# EAGLE design RFM73 Cape (EAGLE 6.5.0)
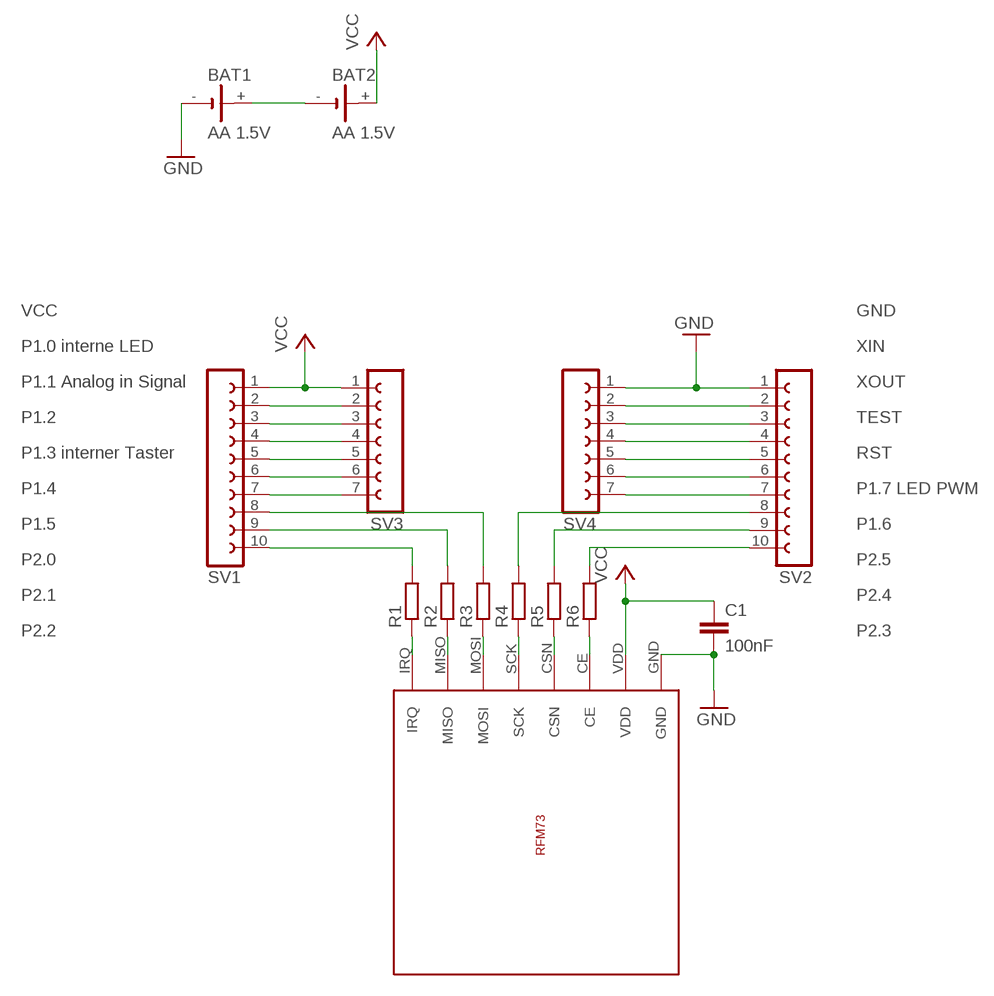
[diagram p0: schematic, sheet 1]

## Parts
BAT1  AA 1.5V  SL-160AA/PR  [SL-160AA/PR]
BAT2  AA 1.5V  SL-160AA/PR  [SL-160AA/PR]
C1  100nF  C-EUC0805  [C0805]
R1  R-EU_R0805W  [R0805W]
R2  R-EU_R0805W  [R0805W]
R3  R-EU_R0805W  [R0805W]
R4  R-EU_R0805W  [R0805W]
R5  R-EU_R0805W  [R0805W]
R6  R-EU_R0805W  [R0805W]
SV1  FE10-1  [FE10]
SV2  FE10-1  [FE10]
SV3  FE07-1  [FE07]
SV4  FE07-1  [FE07]
U$1  RFM73  [RFM73]

## Nets
GND: BAT1.- C1.2 SV2.1 SV4.1 U$1.GND
N$1: R1.2 SV1.10
N$2: BAT1.+ BAT2.-
N$3: R2.2 SV1.9
N$4: R3.2 SV1.8
N$5: R4.2 SV2.8
N$6: R5.2 SV2.9
N$7: R6.2 SV2.10
N$8: SV1.2 SV3.2
N$9: SV1.3 SV3.3
N$10: SV1.4 SV3.4
N$11: SV1.5 SV3.5
N$12: SV1.6 SV3.6
N$13: SV1.7 SV3.7
N$14: SV2.2 SV4.2
N$15: SV2.3 SV4.3
N$16: SV2.4 SV4.4
N$17: SV2.5 SV4.5
N$18: SV2.6 SV4.6
N$19: SV2.7 SV4.7
N$20: R1.1 U$1.IRQ
N$21: R2.1 U$1.MISO
N$22: R3.1 U$1.MOSI
N$23: R4.1 U$1.SCK
N$24: R5.1 U$1.CSN
N$25: R6.1 U$1.CE
VCC: BAT2.+ C1.1 SV1.1 SV3.1 U$1.VDD

## Notes on the sheet
- VCC | GND
- P1.0 interne LED | XIN
- P1.1 Analog in Signal | XOUT
- P1.2 | TEST
- P1.3 interner Taster | RST
- P1.4 | P1.7 LED PWM
- P1.5 | P1.6
- P2.0 | P2.5
- P2.1 | P2.4
- P2.2 | P2.3

## Library data of the parts
BAT1 BAT2 = CHA_lib:SL-160AA/PR: LI BATTERY Sonnenschein
C1 = rcl:C-EU: CAPACITOR, European symbol
R1-R6 = rcl:R-EU_: RESISTOR, European symbol
SV1 SV2 = con-lsta:FE10-1: FEMALE HEADER
SV3 SV4 = con-lsta:FE07-1: FEMALE HEADER; OC_FARNELL: unknown; OC_NEWARK: unknown
U$1 = CHA_lib:RFM73

## Board
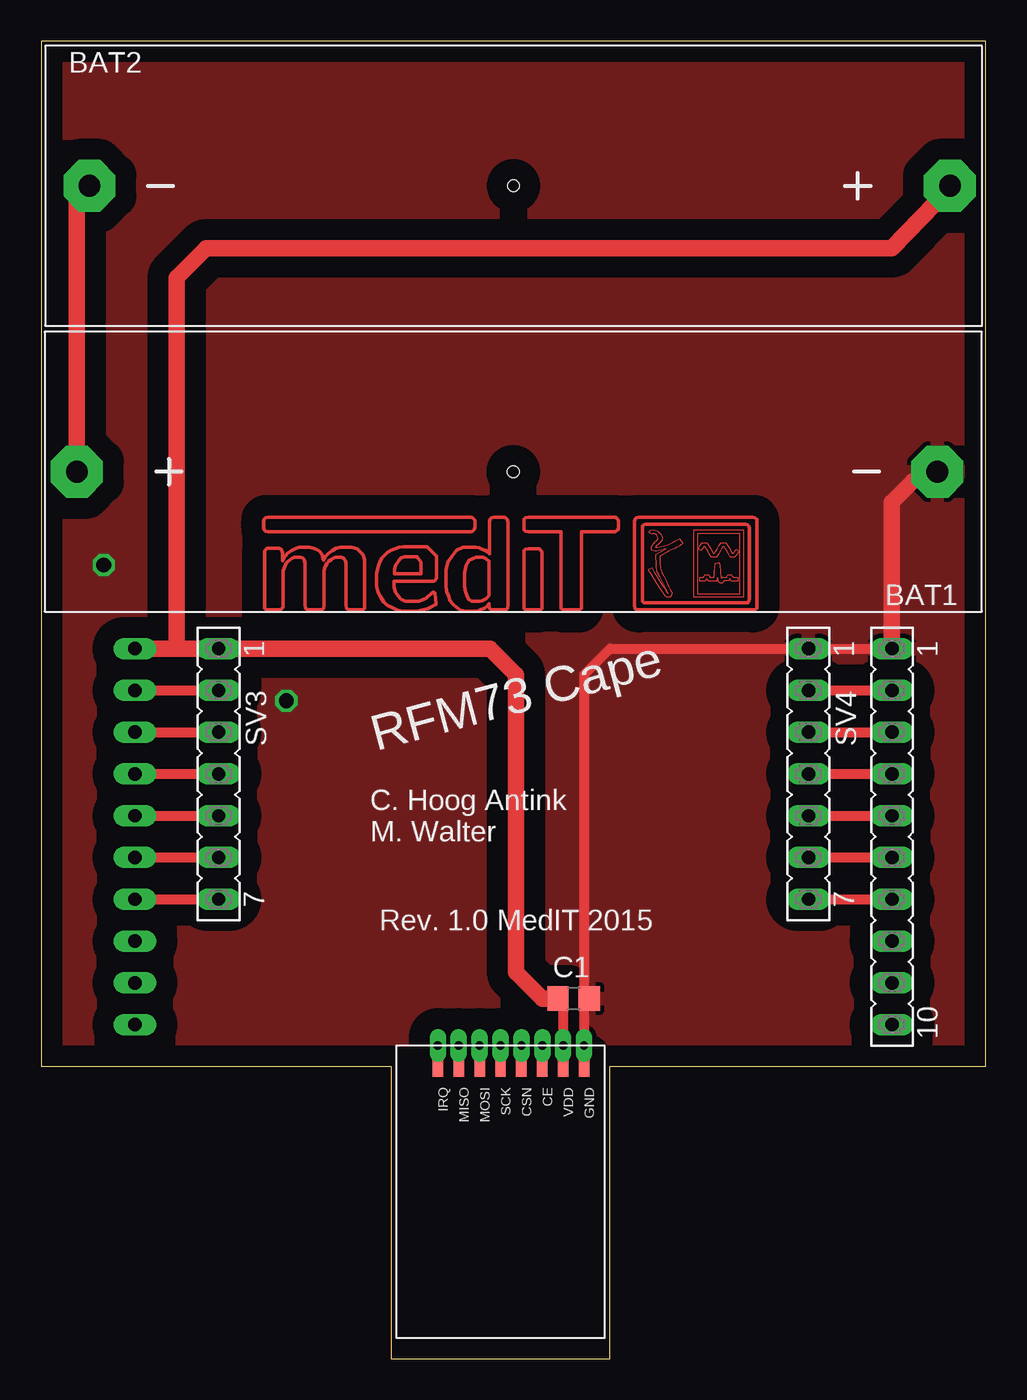
[diagram p1: board, top side]
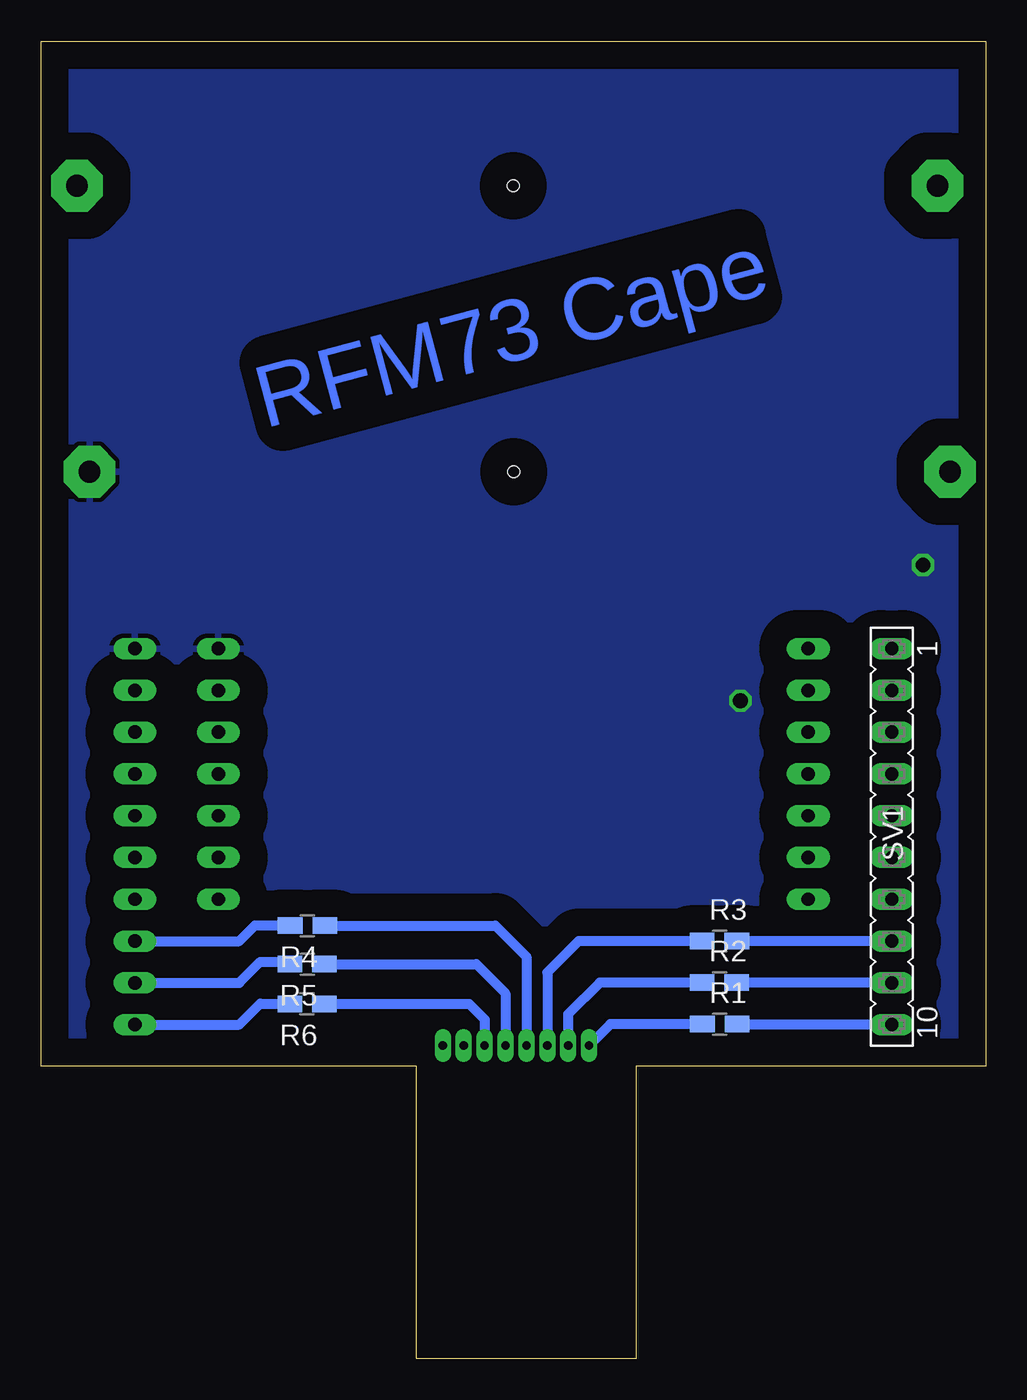
[diagram p2: board, bottom side, seen from below]

Size 57.46 x 80.11 mm. Coordinates in mm from the lower left corner, seen from the top.
Outline: 0,17.78 21.27,17.78 21.27,0 34.61,0 34.61,17.78 57.46,17.78 57.46,80.11 0,80.11 0,17.78
Copper layers (1*16): Top 0.035mm / dielectric 1.5mm / Bottom 0.035mm
Design rules "default *": minimum track width 10mil, minimum drill 24mil, track to track 8mil, track to pad 8mil, pad to pad 8mil, via to via 8mil, smd to smd 8mil, copper to edge 20mil, drill to drill 8mil, minimum pad ring 10mil, minimum via ring 8mil, stop-mask expansion 4mil, vias tented up to drill 0mil, thermal gap 10mil

### Footprints (pad centres in the part's own frame; a part is rotated, then mirrored left to right if it is on the bottom)
SL-160AA/PR = drill 1.321 pad 3.15 octagon: + 26.938,0; - -25.4,0 | hole 0.7: 0.4,0
C0805 = smd 1.3 x 1.5: 1 -0.95,0; 2 0.95,0
R0805W = smd 1.5 x 1: 1 -1.052,0; 2 1.052,0
FE10 = drill 0.813 long: 1 -11.43,0; 2 -8.89,0; 3 -6.35,0; 4 -3.81,0; 5 -1.27,0; 6 1.27,0; 7 3.81,0; 8 6.35,0; 9 8.89,0; 10 11.43,0
FE07 = drill 0.813 long: 1 -7.62,0; 2 -5.08,0; 3 -2.54,0; 4 0,0; 5 2.54,0; 6 5.08,0; 7 7.62,0
RFM73 = drill 0.5 pad 0.813 long: CE -8.89,2.54; CSN -8.89,1.27; GND -8.89,5.08; IRQ -8.89,-3.81; MISO -8.89,-2.54; MOSI -8.89,-1.27; SCK -8.89,0; VDD -8.89,3.81 | smd 1.27 x 0.635: P$1 -7.62,5.08; P$2 -7.62,3.81; P$3 -7.62,2.54; P$4 -7.62,1.27; P$5 -7.62,0; P$6 -7.62,-1.27; P$7 -7.62,-2.54; P$8 -7.62,-3.81

### Placement (x,y rotation side)
BAT1  29.11,53.93 180 top
BAT2  28.34,71.31 0 top
C1  32.39,21.91 0 top
R1  16.18,20.35 0 bottom
R2  16.2,22.88 0 bottom
R3  16.19,25.4 0 bottom
R4  41.26,26.34 180 bottom
R5  41.27,24 180 bottom
R6  41.28,21.58 180 bottom
SV1  5.71,31.75 270 bottom
SV2  51.75,31.75 270 top
SV3  10.79,35.56 270 top
SV4  46.67,35.56 270 top
U$1  27.94,10.16 270 top
U$2  [MEDIT]  28.57,48.26 0 top

### Tracks (layer width: path | path; a pad name or v marks a point on that pad's centre or on a via)
GND  (via drill 0.9)
  Top 0.61: SV2.1 SV4.1 34.61,43.18 33.02,41.59 U$1.GND
  Top 1.016: 53.02,53.34 51.75,52.07 SV2.1
  other vias: 3.81,48.26 14.92,40.01
  pour Bottom (isolate 1.676): -4.45,-0.95 59.69,-0.95 62.23,17.14 61.91,80.96 -4.76,80.96 -6.98,18.42 -9.84,13.34
  pour Top (isolate 1.27): -5.08,81.92 -0.64,16.19 65.09,14.61 60.96,81.6
N$1
  Bottom 0.61: SV1.10 15.11,20.32 R1.2
N$2
  Top 1.016: BAT2.- 2.17,70.36 BAT1.+
N$3
  Bottom 0.61: SV1.9 15.13,22.86 R2.2
N$4
  Bottom 0.61: SV1.8 R3.2
N$5
  Bottom 0.61: SV2.8 45.4,25.4 44.45,26.35 42.32,26.35 R4.2
N$6
  Bottom 0.61: SV2.9 45.4,22.86 44.13,24.13 42.46,24.13 R5.2
N$7
  Bottom 0.61: SV2.10 45.4,20.32 44.13,21.59 R6.2
N$8
  Top 0.61: SV1.2 SV3.2
N$9
  Top 0.61: SV1.3 SV3.3
N$10
  Top 0.61: SV1.4 SV3.4
N$11
  Top 0.61: SV1.5 SV3.5
N$12
  Top 0.61: SV1.6 SV3.6
N$13
  Top 0.61: SV1.7 SV3.7
N$14
  Top 0.61: SV4.2 SV2.2
N$15
  Top 0.61: SV4.3 SV2.3
N$16
  Top 0.61: SV4.4 SV2.4
N$17
  Top 0.61: SV4.5 SV2.5
N$18
  Top 0.61: SV4.6 SV2.6
N$19
  Top 0.61: SV4.7 SV2.7
N$20
  Bottom 0.61: R1.1 22.83,20.35 U$1.IRQ
N$21
  Bottom 0.61: R2.1 23.48,22.88 25.4,20.96 U$1.MISO
N$22
  Bottom 0.61: R3.1 24.76,25.4 26.67,23.5 U$1.MOSI
N$23
  Bottom 0.61: R4.1 29.83,26.34 27.94,24.45 U$1.SCK
N$24
  Bottom 0.61: R5.1 30.98,24 29.21,22.23 U$1.CSN
N$25
  Bottom 0.61: R6.1 31.43,21.58 30.48,20.64 U$1.CE
VCC
  Top 0.61: C1.1 31.75,21.59 U$1.VDD | 8.26,43.48 9.53,43.22 9.56,43.18 | C1.1 | C1.1
  Top 1.016: C1.1 30.48,21.91 28.89,23.5 28.89,41.59 27.3,43.18 SV3.1 9.56,43.18 SV1.1 | BAT2.+ 55.27,71.15 51.73,67.51 10.04,67.5 8.26,65.72 8.26,43.48

### Text on the board
Bottom: RFM73 Cape
tNames: RFM73 Cape | C. Hoog Antink | M. Walter | Rev. 1.0 MedIT 2015
Document: GND | P1.0 | XI | P1.1 | XO | P1.2 | TST | P1.3 | RST | P1.4 | P1.7 | P1.5 | P1.6 | P2.0 - MOSI | SCK - P2.5 | P2.1 - MISO | CSN - P2.4 | P2.2 - IRQ | CE - P2.3